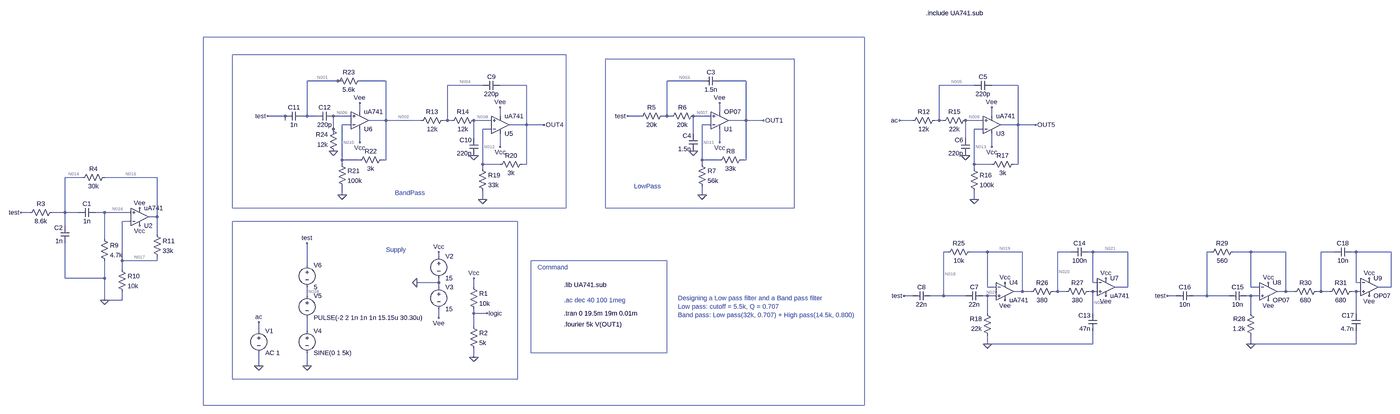
[diagram p0: schematic Filters.asc, whole sheet]
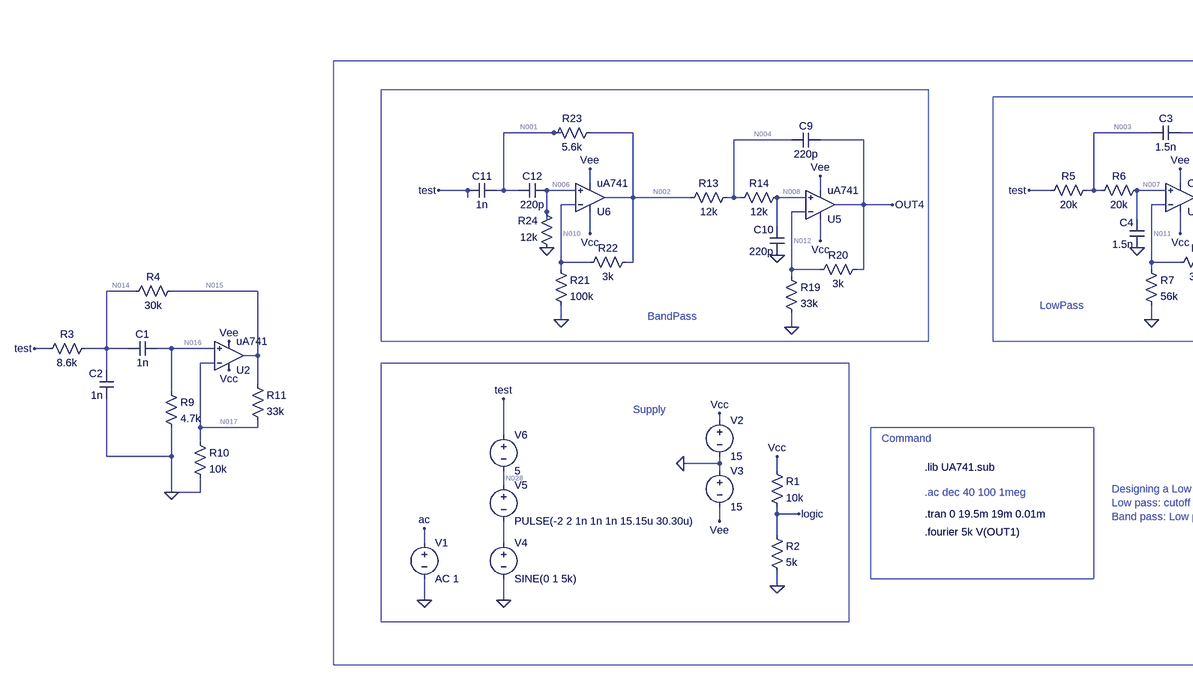
[diagram p1: schematic Filters.asc, part, row 1 of 1, column 1 of 2]
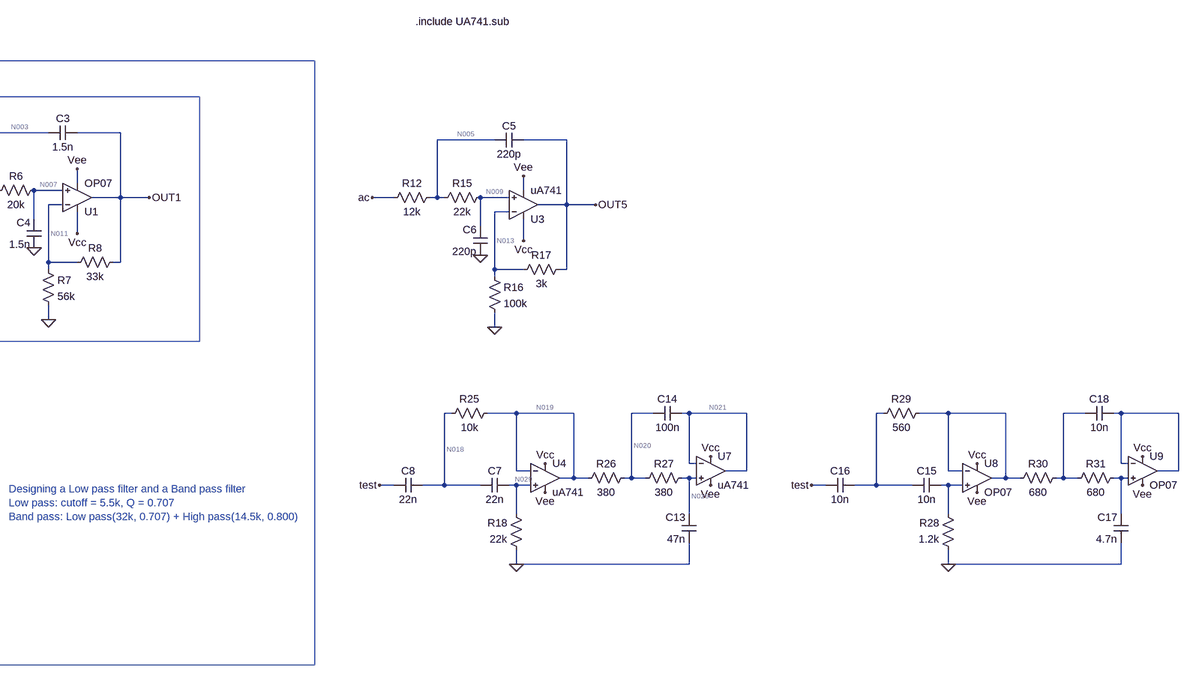
[diagram p2: schematic Filters.asc, part, row 1 of 1, column 2 of 2]
Filters.asc, the LTspice schematic file:
Version 4
SHEET 1 1416 1284
WIRE -3632 96 -3744 96
WIRE -3616 96 -3632 96
WIRE -3456 96 -3552 96
WIRE -2304 96 -2432 96
WIRE -2144 96 -2240 96
WIRE -3104 112 -3232 112
WIRE -2944 112 -3040 112
WIRE -1312 112 -1440 112
WIRE -1152 112 -1248 112
WIRE -3552 208 -3552 176
WIRE -2240 208 -2240 176
WIRE -3824 224 -3888 224
WIRE -3744 224 -3744 96
WIRE -3744 224 -3760 224
WIRE -3712 224 -3744 224
WIRE -3584 224 -3648 224
WIRE -3040 224 -3040 192
WIRE -2528 224 -2576 224
WIRE -2432 224 -2432 96
WIRE -2432 224 -2448 224
WIRE -2416 224 -2432 224
WIRE -2272 224 -2336 224
WIRE -1248 224 -1248 192
WIRE -3824 240 -3824 224
WIRE -3456 240 -3456 96
WIRE -3456 240 -3520 240
WIRE -3328 240 -3456 240
WIRE -3232 240 -3232 112
WIRE -3232 240 -3248 240
WIRE -3216 240 -3232 240
WIRE -3072 240 -3136 240
WIRE -2144 240 -2144 96
WIRE -2144 240 -2208 240
WIRE -2080 240 -2144 240
WIRE -1536 240 -1584 240
WIRE -1440 240 -1440 112
WIRE -1440 240 -1456 240
WIRE -1424 240 -1440 240
WIRE -1280 240 -1344 240
WIRE -3584 256 -3616 256
WIRE -2944 256 -2944 112
WIRE -2944 256 -3008 256
WIRE -2880 256 -2944 256
WIRE -2272 256 -2304 256
WIRE -1152 256 -1152 112
WIRE -1152 256 -1216 256
WIRE -1088 256 -1152 256
WIRE -3648 272 -3648 224
WIRE -3072 272 -3104 272
WIRE -1280 272 -1312 272
WIRE -3648 288 -3648 272
WIRE -2336 288 -2336 224
WIRE -3136 304 -3136 240
WIRE -1344 304 -1344 240
WIRE -3552 320 -3552 272
WIRE -2240 320 -2240 272
WIRE -3040 336 -3040 288
WIRE -1248 336 -1248 288
WIRE -3616 384 -3616 256
WIRE -3552 384 -3616 384
WIRE -3456 384 -3456 240
WIRE -3456 384 -3472 384
WIRE -2304 384 -2304 256
WIRE -2240 384 -2304 384
WIRE -2144 384 -2144 240
WIRE -2144 384 -2160 384
WIRE -3616 400 -3616 384
WIRE -3104 400 -3104 272
WIRE -3040 400 -3104 400
WIRE -2944 400 -2944 256
WIRE -2944 400 -2960 400
WIRE -2304 400 -2304 384
WIRE -1312 400 -1312 272
WIRE -1248 400 -1312 400
WIRE -1152 400 -1152 256
WIRE -1152 400 -1168 400
WIRE -3104 416 -3104 400
WIRE -1312 416 -1312 400
WIRE -4864 448 -4928 448
WIRE -4592 448 -4784 448
WIRE -3616 512 -3616 480
WIRE -2304 512 -2304 480
WIRE -3104 528 -3104 496
WIRE -1312 528 -1312 496
WIRE -5056 576 -5088 576
WIRE -4928 576 -4928 448
WIRE -4928 576 -4976 576
WIRE -4880 576 -4928 576
WIRE -4784 576 -4816 576
WIRE -4688 576 -4784 576
WIRE -4592 592 -4592 448
WIRE -4592 592 -4624 592
WIRE -4688 608 -4720 608
WIRE -4928 624 -4928 576
WIRE -4592 656 -4592 592
WIRE -4784 672 -4784 576
WIRE -1408 720 -1424 720
WIRE -1264 720 -1328 720
WIRE -1136 720 -1264 720
WIRE -960 720 -1008 720
WIRE -880 720 -896 720
WIRE -752 720 -880 720
WIRE -448 720 -464 720
WIRE -304 720 -368 720
WIRE -176 720 -304 720
WIRE 0 720 -48 720
WIRE 80 720 64 720
WIRE 208 720 80 720
WIRE -3264 736 -3264 720
WIRE -4720 752 -4720 608
WIRE -4592 752 -4592 736
WIRE -4592 752 -4720 752
WIRE -3744 768 -3744 688
WIRE -4720 784 -4720 752
WIRE -4928 816 -4928 688
WIRE -4784 816 -4784 752
WIRE -4784 816 -4928 816
WIRE -3264 832 -3264 816
WIRE -3264 832 -3344 832
WIRE -880 832 -880 720
WIRE -864 832 -880 832
WIRE 80 832 80 720
WIRE 96 832 80 832
WIRE -3264 848 -3264 832
WIRE -3136 848 -3136 816
WIRE -1264 848 -1264 720
WIRE -1232 848 -1264 848
WIRE -752 848 -752 720
WIRE -752 848 -800 848
WIRE -304 848 -304 720
WIRE -272 848 -304 848
WIRE 208 848 208 720
WIRE 208 848 160 848
WIRE -1136 864 -1136 720
WIRE -1136 864 -1168 864
WIRE -1104 864 -1136 864
WIRE -1008 864 -1008 720
WIRE -1008 864 -1024 864
WIRE -976 864 -1008 864
WIRE -880 864 -896 864
WIRE -864 864 -880 864
WIRE -176 864 -176 720
WIRE -176 864 -208 864
WIRE -144 864 -176 864
WIRE -48 864 -48 720
WIRE -48 864 -64 864
WIRE -16 864 -48 864
WIRE 80 864 64 864
WIRE 96 864 80 864
WIRE -3744 880 -3744 848
WIRE -1536 880 -1568 880
WIRE -1424 880 -1424 720
WIRE -1424 880 -1472 880
WIRE -1344 880 -1424 880
WIRE -1264 880 -1280 880
WIRE -1232 880 -1264 880
WIRE -576 880 -608 880
WIRE -464 880 -464 720
WIRE -464 880 -512 880
WIRE -384 880 -464 880
WIRE -304 880 -320 880
WIRE -272 880 -304 880
WIRE -4784 896 -4784 816
WIRE -4720 896 -4720 864
WIRE -4720 896 -4784 896
WIRE -3136 944 -3136 928
WIRE -3088 944 -3136 944
WIRE -1264 944 -1264 880
WIRE -880 944 -880 864
WIRE -304 944 -304 880
WIRE 80 944 80 864
WIRE -3264 960 -3264 928
WIRE -3136 992 -3136 944
WIRE -3920 1008 -3920 976
WIRE -3744 1008 -3744 960
WIRE -1264 1056 -1264 1024
WIRE -880 1056 -880 1008
WIRE -880 1056 -1264 1056
WIRE -304 1056 -304 1024
WIRE 80 1056 80 1008
WIRE 80 1056 -304 1056
WIRE -3136 1104 -3136 1072
WIRE -3920 1136 -3920 1088
WIRE -3744 1136 -3744 1088
FLAG -3344 832 0
FLAG -3264 960 Vee
FLAG -3264 720 Vcc
FLAG -3744 1136 0
FLAG -3744 688 test
FLAG -3920 1136 0
FLAG -3920 976 ac
FLAG -2240 320 Vcc
FLAG -2304 512 0
FLAG -2336 352 0
FLAG -2080 240 OUT1
FLAG -2240 176 Vee
FLAG -2576 224 test
FLAG -3040 336 Vcc
FLAG -3104 528 0
FLAG -3136 368 0
FLAG -2880 256 OUT4
FLAG -3040 192 Vee
FLAG -3552 320 Vcc
FLAG -3616 512 0
FLAG -3648 352 0
FLAG -3552 176 Vee
FLAG -3888 224 test
FLAG -3136 1104 0
FLAG -3136 816 Vcc
FLAG -3088 944 logic
FLAG -4784 896 0
FLAG -5088 576 test
FLAG -4656 624 Vcc
FLAG -4656 560 Vee
FLAG -1248 336 Vcc
FLAG -1312 528 0
FLAG -1344 368 0
FLAG -1088 256 OUT5
FLAG -1248 192 Vee
FLAG -1584 240 ac
FLAG -1264 1056 0
FLAG -1200 832 Vcc
FLAG -1200 896 Vee
FLAG -832 880 Vee
FLAG -832 816 Vcc
FLAG -1568 880 test
FLAG -304 1056 0
FLAG -240 832 Vcc
FLAG -240 896 Vee
FLAG 128 880 Vee
FLAG 128 816 Vcc
FLAG -608 880 test
SYMBOL voltage -3264 720 R0
WINDOW 123 0 0 Left 0
WINDOW 39 0 0 Left 0
SYMATTR InstName V2
SYMATTR Value 15
SYMBOL voltage -3264 832 R0
WINDOW 123 0 0 Left 0
WINDOW 39 0 0 Left 0
SYMATTR InstName V3
SYMATTR Value 15
SYMBOL voltage -3744 992 R0
WINDOW 123 0 0 Left 0
WINDOW 39 0 0 Left 0
SYMATTR InstName V4
SYMATTR Value SINE(0 1 5k)
SYMBOL voltage -3744 864 R0
WINDOW 123 0 0 Left 0
WINDOW 39 0 0 Left 0
SYMATTR InstName V5
SYMATTR Value PULSE(-2 2 1n 1n 1n 15.15u 30.30u)
SYMBOL voltage -3744 752 R0
WINDOW 123 0 0 Left 0
WINDOW 39 0 0 Left 0
SYMATTR InstName V6
SYMATTR Value 5
SYMBOL voltage -3920 992 R0
SYMATTR InstName V1
SYMATTR Value AC 1
SYMBOL Opamps\\OP07 -2240 304 M180
SYMATTR InstName U1
SYMBOL res -2432 208 R90
WINDOW 0 0 56 VBottom 2
WINDOW 3 32 56 VTop 2
SYMATTR InstName R5
SYMATTR Value 20k
SYMBOL res -2320 208 R90
WINDOW 0 0 56 VBottom 2
WINDOW 3 32 56 VTop 2
SYMATTR InstName R6
SYMATTR Value 20k
SYMBOL cap -2240 80 R90
WINDOW 0 0 32 VBottom 2
WINDOW 3 32 32 VTop 2
SYMATTR InstName C3
SYMATTR Value 1.5n
SYMBOL cap -2320 352 R180
WINDOW 0 24 56 Left 2
WINDOW 3 24 8 Left 2
SYMATTR InstName C4
SYMATTR Value 1.5n
SYMBOL res -2320 384 R0
SYMATTR InstName R7
SYMATTR Value 56k
SYMBOL res -2144 368 R90
WINDOW 0 0 56 VBottom 2
WINDOW 3 32 56 VTop 2
SYMATTR InstName R8
SYMATTR Value 33k
SYMBOL res -3232 224 R90
WINDOW 0 0 56 VBottom 2
WINDOW 3 32 56 VTop 2
SYMATTR InstName R13
SYMATTR Value 12k
SYMBOL res -3120 224 R90
WINDOW 0 0 56 VBottom 2
WINDOW 3 32 56 VTop 2
SYMATTR InstName R14
SYMATTR Value 12k
SYMBOL cap -3040 96 R90
WINDOW 0 0 32 VBottom 2
WINDOW 3 32 32 VTop 2
SYMATTR InstName C9
SYMATTR Value 220p
SYMBOL cap -3120 368 R180
WINDOW 0 24 56 Left 2
WINDOW 3 24 8 Left 2
SYMATTR InstName C10
SYMATTR Value 220p
SYMBOL res -3120 400 R0
SYMATTR InstName R19
SYMATTR Value 33k
SYMBOL res -2944 384 R90
WINDOW 0 0 56 VBottom 2
WINDOW 3 32 56 VTop 2
SYMATTR InstName R20
SYMATTR Value 3k
SYMBOL Opamps\\uA741 -3040 320 M180
SYMATTR InstName U5
SYMBOL res -3632 384 R0
SYMATTR InstName R21
SYMATTR Value 100k
SYMBOL res -3456 368 R90
WINDOW 0 0 56 VBottom 2
WINDOW 3 32 56 VTop 2
SYMATTR InstName R22
SYMATTR Value 3k
SYMBOL Opamps\\uA741 -3552 304 M180
SYMATTR InstName U6
SYMBOL res -3536 80 R90
WINDOW 0 0 56 VBottom 2
WINDOW 3 32 56 VTop 2
SYMATTR InstName R23
SYMATTR Value 5.6k
SYMBOL res -3632 368 R180
WINDOW 0 36 76 Left 2
WINDOW 3 36 40 Left 2
SYMATTR InstName R24
SYMATTR Value 12k
SYMBOL cap -3760 208 R90
WINDOW 0 0 32 VBottom 2
WINDOW 3 32 32 VTop 2
SYMATTR InstName C11
SYMATTR Value 1n
SYMBOL cap -3648 208 R90
WINDOW 0 0 32 VBottom 2
WINDOW 3 32 32 VTop 2
SYMATTR InstName C12
SYMATTR Value 220p
SYMBOL res -3152 832 R0
SYMATTR InstName R1
SYMATTR Value 10k
SYMBOL res -3152 976 R0
SYMATTR InstName R2
SYMATTR Value 5k
SYMBOL res -4960 560 R90
WINDOW 0 0 56 VBottom 2
WINDOW 3 32 56 VTop 2
SYMATTR InstName R3
SYMATTR Value 8.6k
SYMBOL res -4768 432 R90
WINDOW 0 0 56 VBottom 2
WINDOW 3 32 56 VTop 2
SYMATTR InstName R4
SYMATTR Value 30k
SYMBOL res -4800 656 R0
SYMATTR InstName R9
SYMATTR Value 4.7k
SYMBOL cap -4816 560 R90
WINDOW 0 0 32 VBottom 2
WINDOW 3 32 32 VTop 2
SYMATTR InstName C1
SYMATTR Value 1n
SYMBOL cap -4912 688 R180
WINDOW 0 24 56 Left 2
WINDOW 3 24 8 Left 2
SYMATTR InstName C2
SYMATTR Value 1n
SYMBOL res -4736 768 R0
SYMATTR InstName R10
SYMATTR Value 10k
SYMBOL res -4608 640 R0
SYMATTR InstName R11
SYMATTR Value 33k
SYMBOL Opamps\\uA741 -4656 656 M180
SYMATTR InstName U2
SYMBOL res -1440 224 R90
WINDOW 0 0 56 VBottom 2
WINDOW 3 32 56 VTop 2
SYMATTR InstName R12
SYMATTR Value 12k
SYMBOL res -1328 224 R90
WINDOW 0 0 56 VBottom 2
WINDOW 3 32 56 VTop 2
SYMATTR InstName R15
SYMATTR Value 22k
SYMBOL cap -1248 96 R90
WINDOW 0 0 32 VBottom 2
WINDOW 3 32 32 VTop 2
SYMATTR InstName C5
SYMATTR Value 220p
SYMBOL cap -1328 368 R180
WINDOW 0 24 56 Left 2
WINDOW 3 24 8 Left 2
SYMATTR InstName C6
SYMATTR Value 220p
SYMBOL res -1328 400 R0
SYMATTR InstName R16
SYMATTR Value 100k
SYMBOL res -1152 384 R90
WINDOW 0 0 56 VBottom 2
WINDOW 3 32 56 VTop 2
SYMATTR InstName R17
SYMATTR Value 3k
SYMBOL Opamps\\uA741 -1248 320 M180
SYMATTR InstName U3
SYMBOL Opamps\\uA741 -1200 800 R0
SYMATTR InstName U4
SYMBOL Opamps\\uA741 -832 784 R0
SYMATTR InstName U7
SYMBOL cap -1280 864 R90
WINDOW 0 0 32 VBottom 2
WINDOW 3 32 32 VTop 2
SYMATTR InstName C7
SYMATTR Value 22n
SYMBOL cap -1472 864 R90
WINDOW 0 0 32 VBottom 2
WINDOW 3 32 32 VTop 2
SYMATTR InstName C8
SYMATTR Value 22n
SYMBOL res -1248 1040 R180
WINDOW 0 36 76 Left 2
WINDOW 3 36 40 Left 2
SYMATTR InstName R18
SYMATTR Value 22k
SYMBOL res -1424 736 R270
WINDOW 0 32 56 VTop 2
WINDOW 3 0 56 VBottom 2
SYMATTR InstName R25
SYMATTR Value 10k
SYMBOL res -1008 848 R90
WINDOW 0 0 56 VBottom 2
WINDOW 3 32 56 VTop 2
SYMATTR InstName R26
SYMATTR Value 380
SYMBOL res -880 848 R90
WINDOW 0 0 56 VBottom 2
WINDOW 3 32 56 VTop 2
SYMATTR InstName R27
SYMATTR Value 380
SYMBOL cap -864 1008 R180
WINDOW 0 24 56 Left 2
WINDOW 3 24 8 Left 2
SYMATTR InstName C13
SYMATTR Value 47n
SYMBOL cap -960 736 R270
WINDOW 0 32 32 VTop 2
WINDOW 3 0 32 VBottom 2
SYMATTR InstName C14
SYMATTR Value 100n
SYMBOL cap -320 864 R90
WINDOW 0 0 32 VBottom 2
WINDOW 3 32 32 VTop 2
SYMATTR InstName C15
SYMATTR Value 10n
SYMBOL cap -512 864 R90
WINDOW 0 0 32 VBottom 2
WINDOW 3 32 32 VTop 2
SYMATTR InstName C16
SYMATTR Value 10n
SYMBOL res -288 1040 R180
WINDOW 0 36 76 Left 2
WINDOW 3 36 40 Left 2
SYMATTR InstName R28
SYMATTR Value 1.2k
SYMBOL res -464 736 R270
WINDOW 0 32 56 VTop 2
WINDOW 3 0 56 VBottom 2
SYMATTR InstName R29
SYMATTR Value 560
SYMBOL res -48 848 R90
WINDOW 0 0 56 VBottom 2
WINDOW 3 32 56 VTop 2
SYMATTR InstName R30
SYMATTR Value 680
SYMBOL res 80 848 R90
WINDOW 0 0 56 VBottom 2
WINDOW 3 32 56 VTop 2
SYMATTR InstName R31
SYMATTR Value 680
SYMBOL cap 96 1008 R180
WINDOW 0 24 56 Left 2
WINDOW 3 24 8 Left 2
SYMATTR InstName C17
SYMATTR Value 4.7n
SYMBOL cap 0 736 R270
WINDOW 0 32 32 VTop 2
WINDOW 3 0 32 VBottom 2
SYMATTR InstName C18
SYMATTR Value 10n
SYMBOL Opamps\\OP07 -240 800 R0
SYMATTR InstName U8
SYMBOL Opamps\\OP07 128 784 R0
SYMATTR InstName U9
TEXT -2808 840 Left 2 !.lib UA741.sub
TEXT -2808 896 Left 2 ;.ac dec 40 100 1meg
TEXT -2808 944 Left 2 !.tran 0 19.5m 19m 0.01m
TEXT -2808 984 Left 2 !.fourier 5k V(OUT1)
TEXT -3424 504 Left 2 ;BandPass
TEXT -2552 480 Left 2 ;LowPass
TEXT -3456 712 Left 2 ;Supply
TEXT -2904 776 Left 2 ;Command
TEXT -2392 888 Left 2 ;Designing a Low pass filter and a Band pass filter\nLow pass: cutoff = 5.5k, Q = 0.707\nBand pass: Low pass(32k, 0.707) + High pass(14.5k, 0.800)
TEXT -1488 -152 Left 2 !.include UA741.sub
RECTANGLE Normal -4016 0 -2800 560
RECTANGLE Normal -2656 16 -1968 560
RECTANGLE Normal -4016 608 -2976 1184
RECTANGLE Normal -2928 752 -2432 1088
RECTANGLE Normal -4224 -64 -1712 1280

The netlist it stands for:
* Filters.asc
V2 Vcc 0 15
V3 0 Vee 15
V4 N031 0 SINE(0 1 5k)
V5 N028 N031 PULSE(-2 2 1n 1n 1n 15.15u 30.30u)
V6 test N028 5
V1 ac 0 AC 1
XU1 N007 N011 Vcc Vee OUT1 LT1001  ; OP07, pins In+ In- V+ V- OUT
R5 N003 test 20k
R6 N007 N003 20k
C3 OUT1 N003 1.5n
C4 0 N007 1.5n
R7 N011 0 56k
R8 OUT1 N011 33k
R13 N004 N002 12k
R14 N008 N004 12k
C9 OUT4 N004 220p
C10 0 N008 220p
R19 N012 0 33k
R20 OUT4 N012 3k
XU5 N008 N012 Vcc Vee OUT4 uA741  ; pins In+ In- V+ V- OUT
R21 N010 0 100k
R22 N002 N010 3k
XU6 N006 N010 Vcc Vee N002 uA741  ; pins In+ In- V+ V- OUT
R23 N002 N001 5.6k
R24 0 N006 12k
C11 N001 test 1n
C12 N006 N001 220p
R1 Vcc logic 10k
R2 logic 0 5k
R3 N014 test 8.6k
R4 N015 N014 30k
R9 N016 0 4.7k
C1 N016 N014 1n
C2 0 N014 1n
R10 N017 0 10k
R11 N015 N017 33k
XU2 N016 N017 Vcc Vee N015 uA741  ; pins In+ In- V+ V- OUT
R12 N005 ac 12k
R15 N009 N005 22k
C5 OUT5 N005 220p
C6 0 N009 220p
R16 N013 0 100k
R17 OUT5 N013 3k
XU3 N009 N013 Vcc Vee OUT5 uA741  ; pins In+ In- V+ V- OUT
XU4 N029 N019 Vcc Vee N019 uA741  ; pins In+ In- V+ V- OUT
XU7 N026 N021 Vcc Vee N021 uA741  ; pins In+ In- V+ V- OUT
C7 N029 N018 22n
C8 N018 test 22n
R18 0 N029 22k
R25 N018 N019 10k
R26 N020 N019 380
R27 N026 N020 380
C13 0 N026 47n
C14 N020 N021 100n
C15 N030 N022 10n
C16 N022 test 10n
R28 0 N030 1.2k
R29 N022 N023 560
R30 N024 N023 680
R31 N027 N024 680
C17 0 N027 4.7n
C18 N024 N025 10n
XU8 N030 N023 Vcc Vee N023 LT1001  ; OP07, pins In+ In- V+ V- OUT
XU9 N027 N025 Vcc Vee N025 LT1001  ; OP07, pins In+ In- V+ V- OUT
.lib UA741.sub
* .ac dec 40 100 1meg
.tran 0 19.5m 19m 0.01m
.fourier 5k V(OUT1)
* BandPass
* LowPass
* Supply
* Command
* Designing a Low pass filter and a Band pass filter
* Low pass: cutoff = 5.5k, Q = 0.707
* Band pass: Low pass(32k, 0.707) + High pass(14.5k, 0.800)
.include UA741.sub
.lib LTC.lib
.backanno
.end

* Results of the author's LTspice run, read from the files saved beside the schematic
* Operating Point, zero values left out:
*   V(vcc) = 15 V
*   V(vee) = -15 V
*   V(n028) = -2 V
*   V(test) = 3 V
*   V(n011) = 3 V
*   V(n007) = 3 V
*   V(out1) = 4.768 V
*   V(n003) = 3 V
*   V(n004) = -1.692 mV
*   V(n002) = -734.7 µV
*   V(n008) = -2.648 mV
*   V(out4) = -2.638 mV
*   V(n012) = -2.637 mV
*   V(n010) = -945.6 µV
*   V(n006) = -956.8 µV
*   V(n001) = -734.7 µV
*   V(logic) = 5 V
*   V(n014) = 2.332 V
*   V(n015) = 1.069 mV
*   V(n016) = -374.8 µV
*   V(n017) = -363.5 µV
*   V(n005) = -956.8 µV
*   V(n009) = -2.711 mV
*   V(out5) = -2.541 mV
*   V(n013) = -2.7 mV
*   V(n019) = -1.743 mV
*   V(n029) = -1.754 mV
*   V(n021) = -1.792 mV
*   V(n026) = -1.804 mV
*   V(n018) = -1.743 mV
*   V(n020) = -1.773 mV
*   I(R27) = -79.73 nA
*   I(R26) = -79.73 nA
*   I(R18) = 79.73 nA
*   I(R17) = 52.76 nA
*   I(R16) = -27 nA
*   I(R15) = -79.73 nA
*   I(R12) = -79.73 nA
*   I(R11) = 43.41 nA
*   I(R10) = -36.35 nA
*   I(R9) = -79.74 nA
*   I(R4) = -77.69 µA
*   I(R3) = -77.69 µA
*   I(R2) = 1 mA
*   I(R1) = 1 mA
*   I(R24) = 79.74 nA
*   I(R22) = 70.3 nA
*   I(R21) = -9.456 nA
*   I(R20) = -154.9 pA
*   I(R19) = -79.91 nA
*   I(R14) = -79.73 nA
*   I(R13) = -79.73 nA
*   I(R8) = 53.57 µA
*   I(R7) = 53.57 µA
*   I(R6) = -5.443 pA
*   I(R5) = -5.443 pA
*   I(V1) = -79.73 nA
*   I(V6) = -77.69 µA
*   I(V5) = -77.69 µA
*   I(V4) = -77.69 µA
*   I(V3) = -16.72 mA
*   I(V2) = -17.78 mA
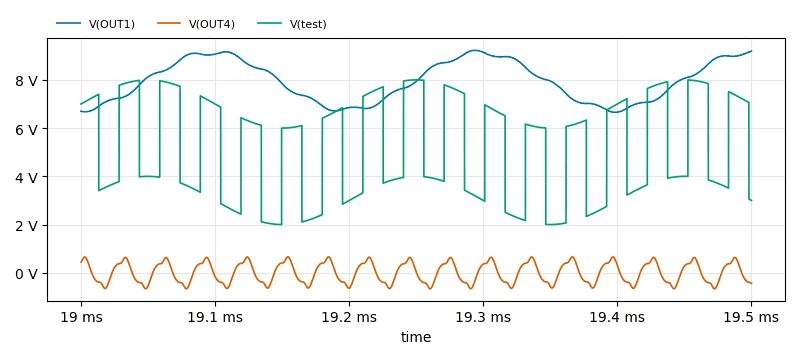
[diagram p3: Transient Analysis of Filters.asc, plotted from the saved traces]
* Transient Analysis, 1 run:
*   V(OUT1): min 6.656 V, max 9.225 V, average 7.955 V, rms 8 V, last 9.195 V
*   V(OUT4): min -665.3 mV, max 663.1 mV, average -1.162 mV, rms 413.4 mV, last -445.6 mV
*   V(test): min 2 V, max 8 V, average 5.173 V, rms 5.588 V, last 3 V
* From the log:
*   N-Period=1
*   Fourier components of V(out1)
*   DC component:7.94203
*   Harmonic  Frequency   Fourier   Normalized   Phase    Normalized
*    Number     [Hz]     Component   Component  [degree]  Phase [deg]
*       1     5.000e+03  1.182e+00  1.000e+00    -86.28°      0.00°
*       2     1.000e+04  1.014e-02  8.584e-03    -85.51°      0.77°
*       3     1.500e+04  1.164e-02  9.853e-03     96.55°    182.83°
*       4     2.000e+04  1.468e-02  1.242e-02    -81.05°      5.23°
*       5     2.500e+04  2.187e-02  1.851e-02    101.00°    187.28°
*       6     3.000e+04  5.403e-02  4.573e-02    -76.79°      9.49°
*       7     3.500e+04  7.585e-02  6.420e-02    -74.64°     11.64°
*       8     4.000e+04  2.032e-02  1.720e-02    107.44°    193.72°
*       9     4.500e+04  1.119e-02  9.472e-03    -70.32°     15.96°
*   Total Harmonic Distortion: 8.523636%(8.603635%)